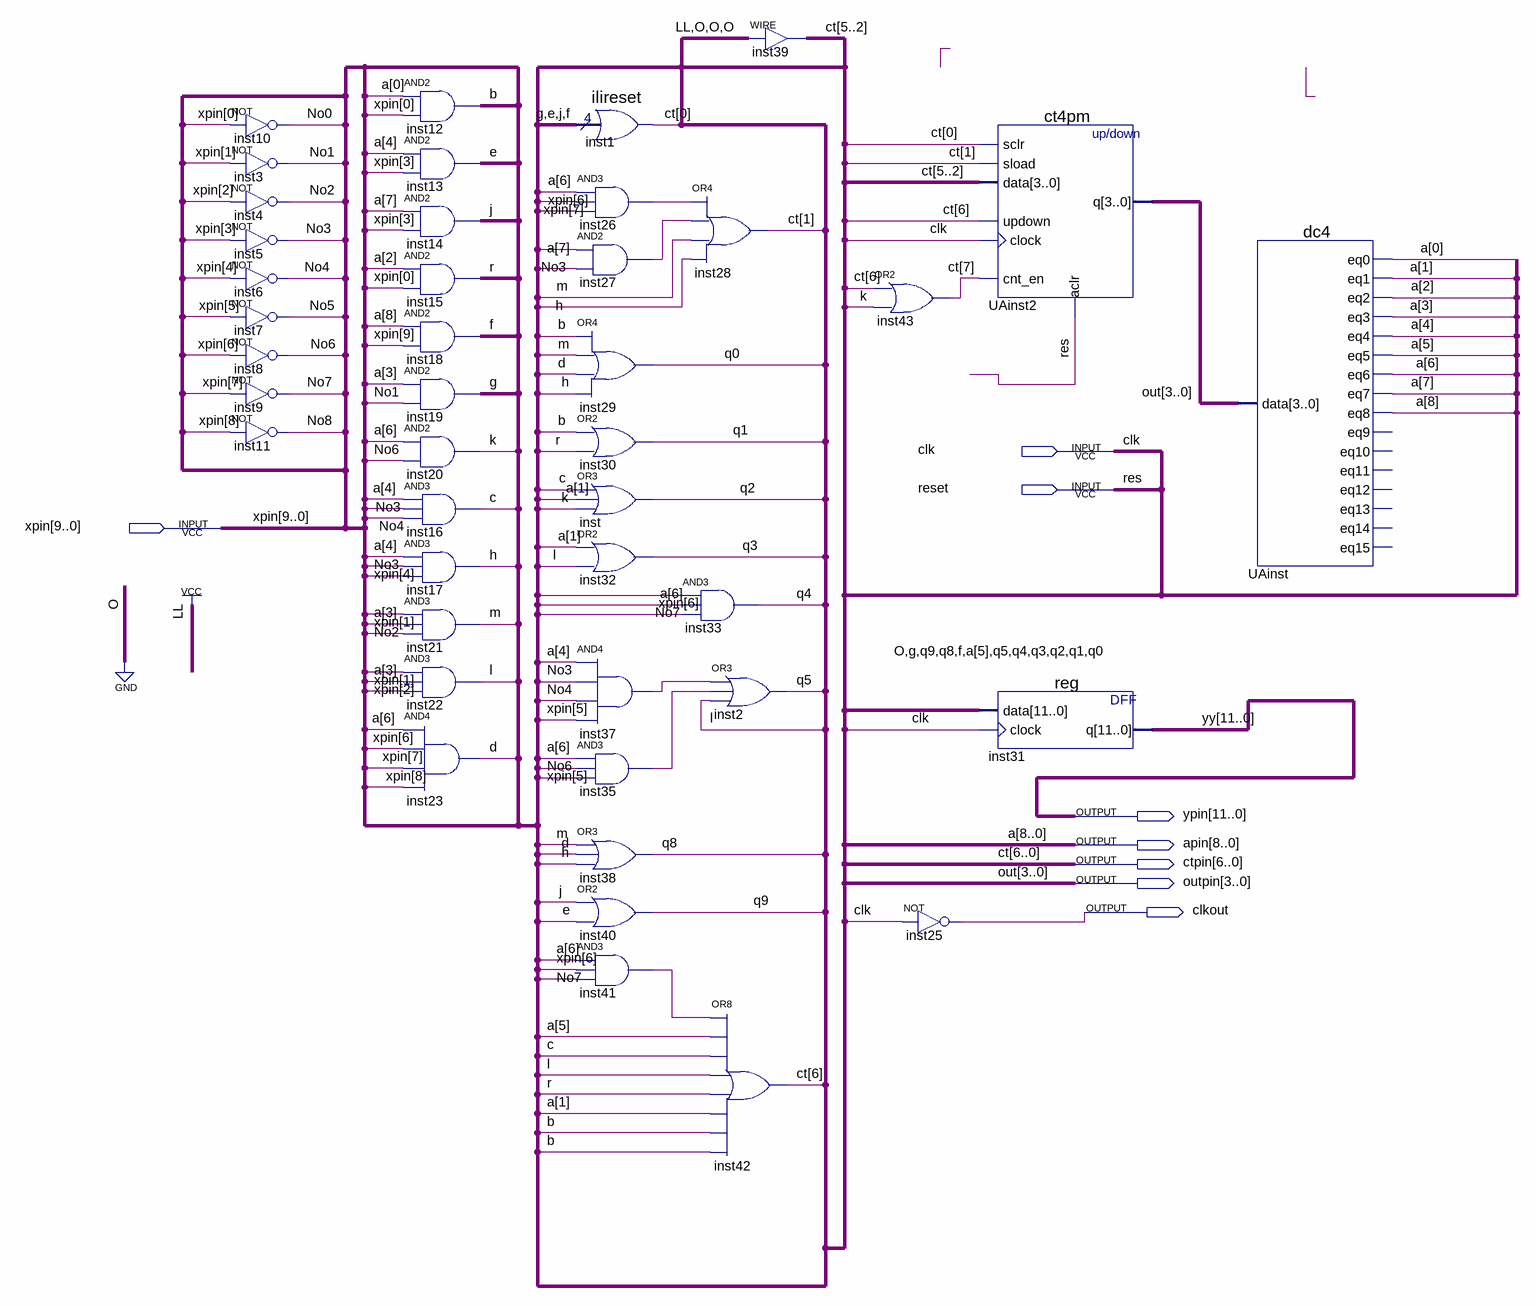
[diagram p0: schematic sheet]
// Quartus schematic UAcourseProject.bdf as structural Verilog: 43 symbols, 8 pins
module UAcourseProject (
  input  clk,
  input  reset,
  input  [9:0] xpin,
  output [11:0] ypin,
  output [8:0] apin,
  output [6:0] ctpin,
  output [3:0] outpin,
  output clkout
);

  wire b, c, d, e, f, g, h, inst26_out, inst27_out, inst35_out, inst37_out, inst41_out, j, k, l, m, No0, No1,
       No2, No3, No4, No5, No6, No7, No8, q0, q1, q2, q3, q4, q5, q8, q9, r;
  wire [7:7] ct;

  not inst10 (No0, xpin[0]);
  not inst3 (No1, xpin[1]);
  not inst4 (No2, xpin[2]);
  not inst5 (No3, xpin[3]);
  not inst6 (No4, xpin[4]);
  not inst7 (No5, xpin[5]);
  not inst8 (No6, xpin[6]);
  not inst9 (No7, xpin[7]);
  not inst11 (No8, xpin[8]);
  and inst12 (b, apin[0], xpin[0]);
  and inst13 (e, apin[4], xpin[3]);
  and inst14 (j, apin[7], xpin[3]);
  and inst15 (r, apin[2], xpin[0]);
  and inst18 (f, apin[8], xpin[9]);
  and inst19 (g, apin[3], No1);
  and inst20 (k, apin[6], No6);
  and inst16 (c, apin[4], No3, No4);
  and inst17 (h, apin[4], No3, xpin[4]);
  and inst21 (m, apin[3], xpin[1], No2);
  and inst22 (l, apin[3], xpin[1], xpin[2]);
  and inst23 (d, apin[6], xpin[6], xpin[7], xpin[8]);
  ilireset inst1 (.data({g, e, j, f}), .result(ctpin[0]));
  and inst26 (inst26_out, apin[6], xpin[6], xpin[7]);
  and inst27 (inst27_out, apin[7], No3);
  or inst29 (q0, b, m, d, h);
  or inst30 (q1, b, r);
  or inst (q2, c, apin[1], k);
  or inst32 (q3, apin[1], l);
  and inst37 (inst37_out, apin[4], No3, No4, xpin[5]);
  and inst35 (inst35_out, apin[6], No6, xpin[5]);
  or inst38 (q8, m, d, h);
  or inst40 (q9, j, e);
  and inst41 (inst41_out, apin[6], xpin[6], No7);
  or inst28 (ctpin[1], inst26_out, inst27_out, m, h);
  and inst33 (q4, apin[6], xpin[6], No7);
  or inst2 (q5, inst37_out, inst35_out, l);
  or inst42 (ctpin[6], inst41_out, apin[5], c, l, r, apin[1], b, b);
  assign ctpin[5:2] = 4'b1000;  // WIRE inst39
  or inst43 (ct[7], ctpin[6], k);
  not inst25 (clkout, clk);
  ct4pm UAinst2 (
    .sclr(ctpin[0]), .sload(ctpin[1]), .data(ctpin[5:2]), .updown(ctpin[6]), .clock(clk), .cnt_en(ct[7]),
    .aclr(reset), .q(outpin));
  \reg  inst31 (.data({1'b0, g, q9, q8, f, apin[5], q5, q4, q3, q2, q1, q0}), .clock(clk), .q(ypin));
  dc4 UAinst (
    .data(outpin), .eq0(apin[0]), .eq1(apin[1]), .eq2(apin[2]), .eq3(apin[3]), .eq4(apin[4]), .eq5(apin[5]),
    .eq6(apin[6]), .eq7(apin[7]), .eq8(apin[8]));  // open: eq9, eq10, eq11, eq12, eq13, eq14, eq15

  // Other names for the same wires on the sheet: a[8:0] = apin; ct[6:0] = ctpin; out[3:0] = outpin; res = reset;
  //   yy[11:0] = ypin
endmodule
